# Altium schematic sheet Plugs.SchDoc
size A4
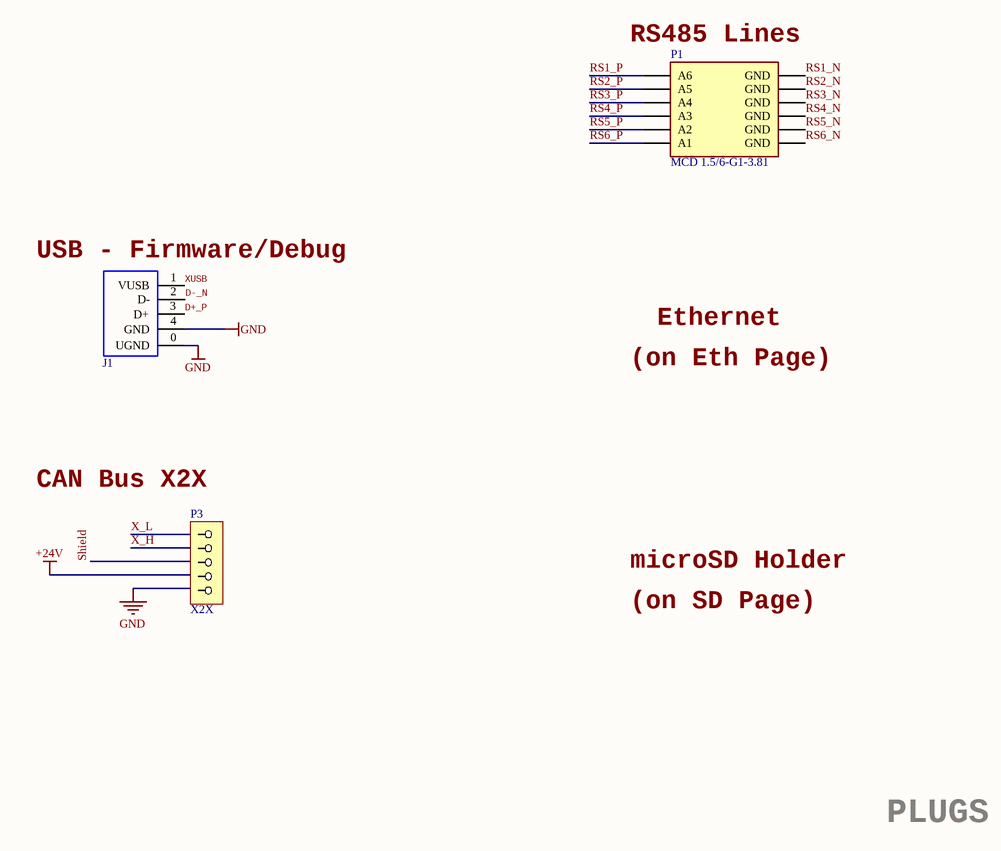
[diagram p0: Plugs.SchDoc]

## Parts
J1  USBB-1J  [USB B]  (value not drawn)
P1  MCD 1.5/6-G1-3.81  [mcd 1,5/6-G1-3.81]
P3  X2X  [PhClass5]

## Nets
+24V: P3.4
GND: J1.0(UGND) J1.4(GND) P3.5
D+_P: J1.3(D+)
D-_N: J1.2(D-)
RS1_N: P1.2(GND)
RS1_P: P1.1(A6)
RS2_N: P1.4(GND)
RS2_P: P1.3(A5)
RS3_N: P1.6(GND)
RS3_P: P1.5(A4)
RS4_N: P1.8(GND)
RS4_P: P1.7(A3)
RS5_N: P1.10(GND)
RS5_P: P1.9(A2)
RS6_N: P1.12(GND)
RS6_P: P1.11(A1)
Shield: P3.3
X_H: P3.2
X_L: P3.1
XUSB: J1.1(VUSB)

## Notes on the sheet
- (near P1) RS485 Lines
- (near J1) USB - Firmware/Debug
- Ethernet
- (on Eth Page)
- (near P3) CAN Bus X2X
- microSD Holder
- (on SD Page)
- PLUGS

## Library data of the parts
P1 = Header 6X2: Header, 6-Pin, Dual row; LatestRevisionDate: 17-Jul-2002; LatestRevisionNote: Re-released for DXP Platform.; Publisher: Altium Limited
P3 = EMSTBA 2.5/5-G-5.08